# Altium schematic sheet Sheet1.SchDoc
size A; SheetNumber: 1; SheetTotal: 1
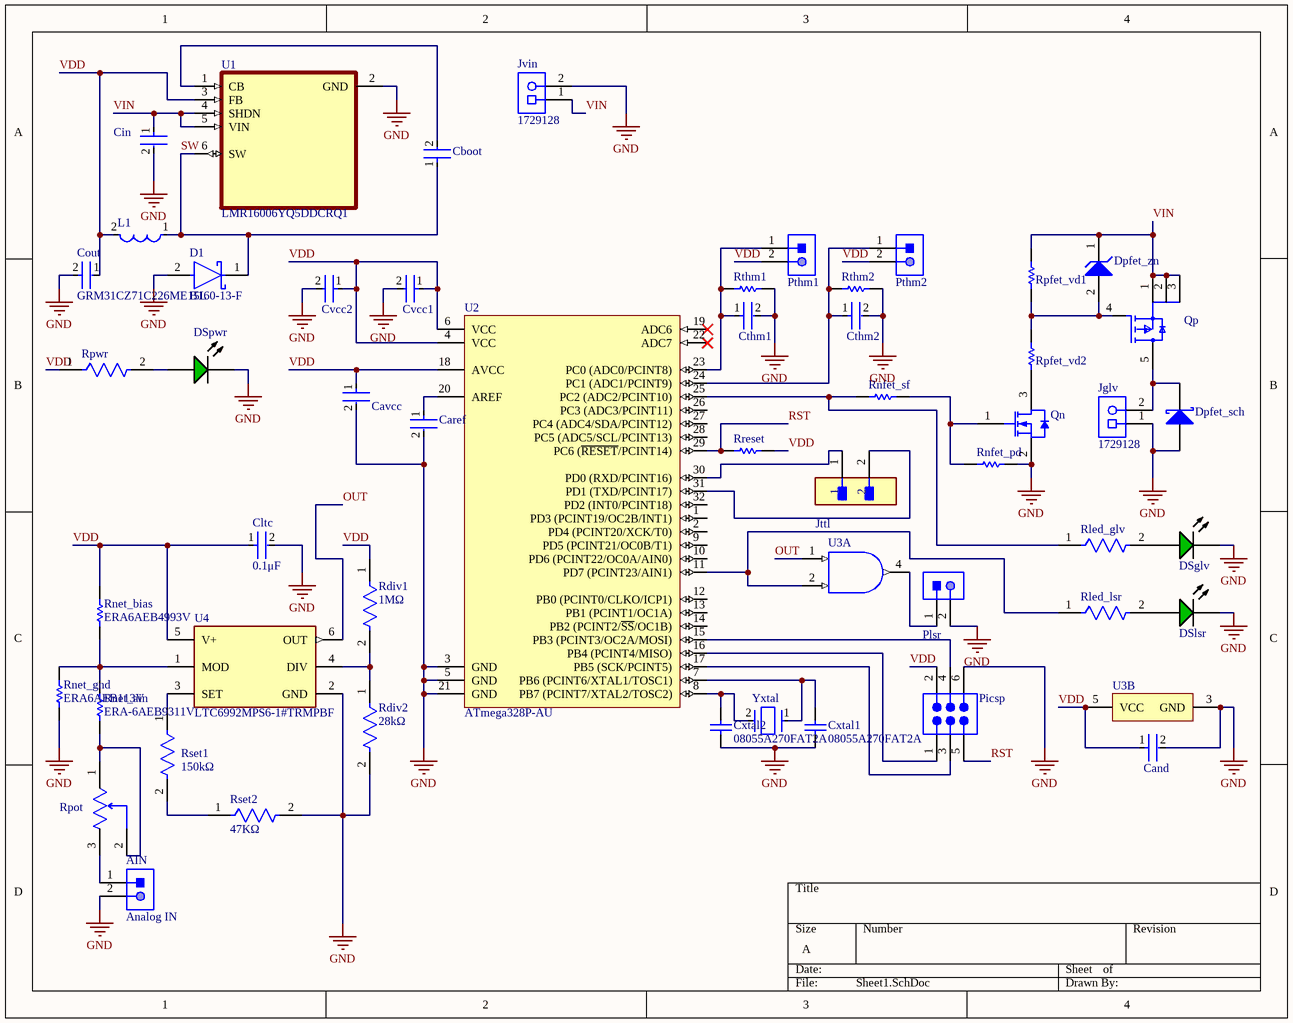
[diagram p0: Sheet1.SchDoc]

## Parts
AIN  Analog IN  [JST-S2B-XH-A(LF)(SN)_V]
Cand  GCM21BR72A104KA37L  [FP-GCM21B-0_15-MFG]  (value not drawn)
Caref  GCM21BR72A104KA37L  [FP-GCM21B-0_15-MFG]  (value not drawn)
Cavcc  GCM21BR72A104KA37L  [FP-GCM21B-0_15-MFG]  (value not drawn)
Cboot  GRM21BR71H474KA88L  [FP-GRM21B-0_1-IPC_B]  (value not drawn)
Cin  GRM31CR71H475KA12L  [FP-GRM31C-0_2-e0_3_0_8-IPC_C]  (value not drawn)
Cltc  0.1μF  [FP-GCM21B-0_15-MFG]
Cout  GRM31CZ71C226ME15L  [FP-GRM31C-0_3-e0_3_0_8-IPC_C]
Cthm1  GCM21BR72A104KA37L  [FP-GCM21B-0_15-MFG]  (value not drawn)
Cthm2  GCM21BR72A104KA37L  [FP-GCM21B-0_15-MFG]  (value not drawn)
Cvcc1  GCM21BR72A104KA37L  [FP-GCM21B-0_15-MFG]  (value not drawn)
Cvcc2  GCM21BR72A104KA37L  [FP-GCM21B-0_15-MFG]  (value not drawn)
Cxtal1  08055A270FAT2A  [CAPC2013X94X50NL20T25]
Cxtal2  08055A270FAT2A  [CAPC2013X94X50NL20T25]
D1  B160-13-F  [FP-SMA-MFG]
Dpfet_sch  B560C-13-F  [DIOD-B5X0C-2_M]  (value not drawn)
Dpfet_zn  MMSZ5245BT1G  [ONSC-SOD-123-2-425-04_V]  (value not drawn)
DSglv  HSMG-C170  [AVAG-HSMX-C170_V]  (value not drawn)
DSlsr  HSMG-C170  [AVAG-HSMX-C170_V]  (value not drawn)
DSpwr  HSMG-C170  [AVAG-HSMX-C170_V]  (value not drawn)
Jglv  1729128  [PHOE-1729128-2_V]
Jttl  TSW-102-07-F-S  [FP-TSW-102-07-F-S-MFG]  (value not drawn)
Jvin  1729128  [PHOE-1729128-2_V]
L1  LQH5BPN100MT0L  [FP-LQH5BPB_T0-MFG]  (value not drawn)
Picsp  MTSW-103-07-F-D-244  [SMTC-MTSW-103-07-X-D-244]  (value not drawn)
Plsr  S2B-XH-A(LF)(SN)  [JST-S2B-XH-A(LF)(SN)_V]  (value not drawn)
Pthm1  S2B-XH-A(LF)(SN)  [JST-S2B-XH-A(LF)(SN)_V]  (value not drawn)
Pthm2  S2B-XH-A(LF)(SN)  [JST-S2B-XH-A(LF)(SN)_V]  (value not drawn)
Qn  2N7002LT1G  [ONSC-SOT-23-3-318-08_V]  (value not drawn)
Qp  SQJ459EP-T1_GE3  [FP-C15-1203-SINGLE-MFG]  (value not drawn)
Rdiv1  1MΩ  [FP-RG2012-MFG]
Rdiv2  28kΩ  [FP-RG2012-MFG]
Rled_glv  CRCW08051K20FKEA  [FP-CRCW0805-e3-MFG]  (value not drawn)
Rled_lsr  CRCW08051K20FKEA  [FP-CRCW0805-e3-MFG]  (value not drawn)
Rnet_ain  ERA-6AEB9311V  [RESC2013X60X40ML20T25]
Rnet_bias  ERA6AEB4993V  [RESC2013X60X40ML20T25]
Rnet_gnd  ERA6AEB113V  [RESC2013X60X40NL20T25]
Rnfet_pd  ERA-6AEB103V  [RESC2013X60X40LL20T25_A]  (value not drawn)
Rnfet_sf  ERA6AEB331V  [RESC2013X60X40LL20T25]  (value not drawn)
Rpfet_vd1  ERA-6AEB103V  [RESC2013X60X40LL20T25_A]  (value not drawn)
Rpfet_vd2  ERA-6AEB103V  [RESC2013X60X40LL20T25_A]  (value not drawn)
Rpot  3296W-1-202LF  [FP-3296W-MFG]  (value not drawn)
Rpwr  CRCW08051K20FKEA  [FP-CRCW0805-e3-MFG]  (value not drawn)
Rreset  ERA-6AEB103V  [RESC2013X60X40LL20T25_A]  (value not drawn)
Rset1  150kΩ  [FP-ERA6A-MFG]
Rset2  47KΩ  [FP-ERA6A-MFG]
Rthm1  ERA-6AEB103V  [RESC2013X60X40LL20T25_A]  (value not drawn)
Rthm2  ERA-6AEB103V  [RESC2013X60X40LL20T25_A]  (value not drawn)
U1  LMR16006YQ5DDCRQ1  [SOT95P280X110-6N]
U2  ATmega328P-AU  [32A_M]
U3  SN74LVC1G08DBVR  [DBV0005A_M]  (value not drawn)  (parts A,B of 2)
U4  LTC6992MPS6-1#TRMPBF  [FP-S6-6-05-08-1636-IPC_B]
Yxtal  ABLS-16.000MHZ-K4T  [FP-ABLS-MFG]  (value not drawn)

## Nets
GND: AIN.2 Cand.2 Caref.2 Cavcc.2 Cin.2 Cltc.2 Cout.2 Cthm1.2 Cthm2.2 Cvcc1.2 Cvcc2.2 Cxtal1.1 Cxtal2.1 D1.2(A) Dpfet_sch.2(A) DSglv.2(K) DSlsr.2(K) DSpwr.2(K) Jglv.1 Jvin.2 Picsp.6 Plsr.2 Qn.2(S) Rdiv2.2 Rnet_gnd.1 Rnfet_pd.2 Rset2.2 Rthm1.2 Rthm2.2 U1.2(GND) U2.3(GND) U2.5(GND) U2.21(GND) U3.3(GND) U4.2(GND)
OUT: U3.1(A) U4.6(OUT)
RST: Picsp.5 Rreset.1 U2.29(PC6_(~{RESET}/PCINT14))
SW: Cboot.1 D1.1(C) L1.1 U1.6(SW)
VDD: Cand.1 Cavcc.1 Cltc.1 Cout.1 Cvcc1.1 Cvcc2.1 L1.2 Picsp.2 Pthm1.2 Pthm2.2 Rdiv1.1 Rnet_bias.2 Rpwr.1 Rreset.2 U1.3(FB) U2.4(VCC) U2.6(VCC) U2.18(AVCC) U3.5(VCC) U4.5(V+)
VIN: Cin.1 Dpfet_zn.1(K) Jvin.1 Qp.1(S) Qp.2(S) Qp.3(S) Rpfet_vd1.2 U1.4(SHDN) U1.5(VIN)
NetAIN_1: AIN.1 Rpot.3(CW)
NetCaref_1: Caref.1 U2.20(AREF)
NetCboot_2: Cboot.2 U1.1(CB)
NetCthm1_1: Cthm1.1 Pthm1.1 Rthm1.1 U2.23(PC0_(ADC0/PCINT8))
NetCthm2_1: Cthm2.1 Pthm2.1 Rthm2.1 U2.24(PC1_(ADC1/PCINT9))
NetCxtal1_2: Cxtal1.2 U2.7(PB6_(PCINT6/XTAL1/TOSC1)) Yxtal.1
NetCxtal2_2: Cxtal2.2 U2.8(PB7_(PCINT7/XTAL2/TOSC2)) Yxtal.2
NetDpfet_sch_1: Dpfet_sch.1(K) Jglv.2 Qp.5(D)
NetDpfet_zn_2: Dpfet_zn.2(A) Qp.4(G) Rpfet_vd1.1 Rpfet_vd2.1
NetDSglv_1: DSglv.1(A) Rled_glv.2
NetDSlsr_1: DSlsr.1(A) Rled_lsr.2
NetDSpwr_1: DSpwr.1(A) Rpwr.2
NetJttl_1: Jttl.1 U2.30(PD0_(RXD/PCINT16))
NetJttl_2: Jttl.2 U2.31(PD1_(TXD/PCINT17))
NetPicsp_1: Picsp.1 U2.16(PB4_(PCINT4/MISO))
NetPicsp_3: Picsp.3 U2.17(PB5_(SCK/PCINT5))
NetPicsp_4: Picsp.4 U2.15(PB3_(PCINT3/OC2A/MOSI))
NetPlsr_1: Plsr.1 U3.4(Y)
NetQn_1: Qn.1(G) Rnfet_pd.1 Rnfet_sf.2
NetQn_3: Qn.3(D) Rpfet_vd2.2
NetRdiv1_2: Rdiv1.2 Rdiv2.1 U4.4(DIV)
NetRled_glv_1: Rled_glv.1 Rnfet_sf.1 U2.25(PC2_(ADC2/PCINT10))
NetRled_lsr_1: Rled_lsr.1 U2.11(PD7_(PCINT23/AIN1)) U3.2(B)
NetRnet_ain_1: Rnet_ain.1 Rpot.1(CCW) Rpot.2(WIPER)
NetRnet_ain_2: Rnet_ain.2 Rnet_bias.1 Rnet_gnd.2 U4.1(MOD)
NetRset1_1: Rset1.1 U4.3(SET)
NetRset1_2: Rset1.2 Rset2.1

Not connected (* = marked no-connect by the designer): U2 1(PD3_(PCINT19/OC2B/INT1)) 2(PD4_(PCINT20/XCK/T0)) 9(PD5_(PCINT21/OC0B/T1)) 10(PD6_(PCINT22/OC0A/AIN0)) 12(PB0_(PCINT0/CLKO/ICP1)) 13(PB1_(PCINT1/OC1A)) 14(PB2_(PCINT2/~{SS}/OC1B)) 19(ADC6)* 22(ADC7)* 26(PC3_(ADC3/PCINT11)) 27(PC4_(ADC4/SDA/PCINT12)) 28(PC5_(ADC5/SCL/PCINT13)) 32(PD2_(INT0/PCINT18))

## Library data of the parts
AIN Plsr Pthm1 Pthm2 = CMP-1755-00005-1: Male Header, Pitch 2.5 mm, 1 x 2 Position, Height 6.1 mm, Tail Length 3.4 mm, -25 to 85 degC, RoHS, Bulk; Type (Capacitors): X7R; Voltage Rating (DC): 100 V; Tolerance: 10%; Capacitance: 1 nF; Case\Package: Radial; Min Operating Temperature: -55 degC; Mount: Through Hole; Package Quantity: 500; PackageReference: S2B-XH-A(LF)(SN); ComponentLink1Description: Manufacturer URL; Max Operating Temperature: 125 degC; ComponentLink2Description: Datasheet; RoHSCompliant: true; PackageDescription: Male Header, Pitch 2.5 mm, 1 x 2 Position, Height 6.1 mm, Tail Length 3.4 mm; REACH SVHC: No SVHC; Packaging: Bulk; Width: 3.81 mm; Length: 5.33 mm; Height: 2.54 mm; Pins: 2; Radiation Hardening: No; ComponentLink1URL: http://www.jst.com/home2.html; Lead Pitch: 2.54 mm; DatasheetVersion: May-16; Voltage Rating: 100 V; ComponentLink2URL: http://www.jst-mfg.com/product/pdf/eng/eXH.pdf
Cand Caref Cavcc Cltc Cthm1 Cthm2 Cvcc1 Cvcc2 = CMP-2007-03364-2: Ceramic Capacitor for Automotive 100nF ±10% 100VDC X7R 0805 Embossed T/R; Voltage Rating: 100V; Termination: SMD/SMT; Tolerance: 10%; Case Code (Imperial): 0805; Length: 2mm; Max Operating Temperature: 125°C; Case/Package: 0805; Mount: Surface Mount; Packaging: Tape and Reel; Package Quantity: 1; Min Operating Temperature: -55°C; Case Code (Metric): 2012; Radiation Hardening: No; REACH SVHC: No SVHC; Dielectric: X7R; Depth: 1.25mm; Lead Free: Lead Free; Ratings: AEC-Q200; Height: 1.25mm; Voltage: 100V; Capacitance: 100nF; Voltage Rating (DC): 100V; Width: 0.049inch; Thickness: 0.055inch
Cboot = CMP-06035-060025-1: Chip Multilayer Ceramic Capacitors for General Purpose, 0805, 0.47uF, X7R, 15%, 10%, 50V; Capacitance: 470nF; Material: Ceramic; Voltage Rating: 50V; Case Code (Imperial): 0805; Depth: 1.25mm; Voltage Rating (DC): 50V; Dielectric: X7R; Construction: Flat; Min Operating Temperature: -55°C; Size: 1.25mm; Package Quantity: 1; Series: GRM; Width: 0.049inch; Case/Package: 0805; Lead Free: Lead Free; Thickness: 0.053inch; Case Code (Metric): 2012; Length: 2mm; Height: 1.25mm; Termination: SMD/SMT; Mount: Surface Mount; Voltage: 50V; Packaging: Tape and Reel; Max Operating Temperature: 125°C; REACH SVHC: No SVHC; Tolerance: 10%
Cin = CMP-1037-04923-3: Chip Multilayer Ceramic Capacitors for General Purpose, 1206, 4.7uF, X7R, 15%, 10%, 50V; Height: 1.6mm; Voltage: 50V; Capacitance: 4.7uF; Lead Free: Lead Free; Max Operating Temperature: 125°C; Packaging: Tape and Reel; REACH SVHC: No SVHC; Voltage Rating: 50V; Mount: Surface Mount; Termination: SMD/SMT; Tolerance: 10%; Case/Package: 1206; Material: Ceramic; Depth: 1.6mm; Length: 3.2mm; Case Code (Metric): 3216; Voltage Rating (DC): 50V; Case Code (Imperial): 1206; Radiation Hardening: No; Width: 0.063inch; Thickness: 0.071inch; Package Quantity: 2000; Min Operating Temperature: -55°C; Dielectric: X7R
Cout = CMP-06035-055218-1: Chip Multilayer Ceramic Capacitors for General Purpose, 1206, 22uF, X7R, 15%, 20%, 16V
Cxtal1 Cxtal2 = CMP-2007-04304-1: Manufacturer: AVX Interconnect / Elco; Part Number: 08055A270FAT2A
D1 = CMP-2000-05885-2: DIODE SCHOTTKY 60V 1A SMA; Polarity: Standard; Element Configuration: Single; Peak Reverse Current: 500uA; Capacitance: 110pF; Peak Non-Repetitive Surge Current: 30A; Forward Voltage: 700mV; Termination: SMD/SMT; Radiation Hardening: No; Number of Pins: 2; Packaging: Tape and Reel; Length: 4.6mm; Current Rating: 1A; Lead Free: Lead Free; Output Current: 1A; Max Operating Temperature: 150°C; Min Operating Temperature: -65°C; Forward Current: 1A; Mount: Surface Mount; Width: 2.92mm; Average Rectified Current: 1A; Max Forward Surge Current (Ifsm): 30A; Voltage Rating (DC): 60V; Height: 2.1mm; REACH SVHC: No SVHC; Max Reverse Voltage (DC): 60V; Max Repetitive Reverse Voltage (Vrrm): 60V; Weight: 0.002258oz; Contact Plating: Tin; Case/Package: SMA; Package Quantity: 5000
Dpfet_sch = CMP-2000-05098-2: Schottky Barrier Rectifier, 5 A, 60 V, -55 to 125 degC, 2-Pin SMD, RoHS, Tape and Reel; Ir - Reverse Current: 500uA; Configuration: Single; Ifsm - Forward Surge Current: 100A; Vrrm - Repetitive Reverse Voltage: 60V; Brand: DiodesIncorporated; Vf - Forward Voltage: 0.7V; If - Forward Current: 5A; Unit Weight: 0.007408oz; Type: SchottkyBarrierRectifier; Package / Case: SMC; Manufacturer URL: http://www.diodes.com/; Datasheet URL: https://datasheet.ciiva.com/27052/1538961-27052355.pdf; Factory Pack Quantity: 3000; Height: 2.5mm; Width: 6.22mm; Product Category: SchottkyDiodes&Rectifiers; Minimum Operating Temperature: -55C; Manufacturer: DiodesIncorporated; Datasheet Version: Rev. 7-2, 06/2007; Product: SchottkyDiodes; Maximum Operating Temperature: +125C; Operating Temperature Range: -55Cto+125C; Technology: Si; Length: 7.11mm; RoHS: True; Packaging: Reel; Termination Style: SMD/SMT; Series: B560; Mounting Style: SMD/SMT
Dpfet_zn = CMP-1060-00535-1: Zener Voltage Regulator, 500 mW, 2-Pin SOD-123, Pb-Free, Tape and Reel; Manufacturer: On Semiconductor; P Max (W): 0.5; VZ Typ (V): 15; ComponentLink3URL: http://www.onsemi.com/pub_link/Collateral/425-04.PDF; Packing: Tape and Reel; DatasheetVersion: Rev. 12; ComponentLink2URL: http://www.onsemi.com/pub_link/Collateral/MMSZ5221BT1-D.PDF; Mounting Technology: Surface Mount; ComponentLink1Description: Manufacturer URL; ComponentLink1URL: http://www.onsemi.com/; ComponentLink2Description: Datasheet; PackageVersion: Rev. G, 10/2009; PackageReference: SOD-123-2-425-04; PackageDescription: 2-Pin SOD, Body 1.6 x 2.69 mm; ComponentLink3Description: Package Specification; RoHS: Pb-Free; PartNumber: MMSZ5245BT1G
DSglv DSlsr DSpwr = CMP-2000-05062-1: Chip LED, Green, 2.2 V, -40 to 85 degC, 2-Pin SMD, Pb-Free, Tape and Reel; Manufacturer: Avago; No. of Pins: 2; Peak Wavelength: 570nm; SVHC: NoSVHC(16-Jun-2014); Dominant Wavelength: 572nm; Forward Current If: 20mA; Viewing Angle: 170deg; Lens Shape: Rectangular; PIV Max: 5V; External Width: 1.25mm; LED Type: Standard; External Depth: 0.8mm; Opto Mounting Orientation: Top; Luminous Intensity: 15mcd; Luminous Intensity Min: 4mcd; Forward Voltage VF Max: 2.6V; External Length / Height: 2mm; Bulb Size: 1.25mmx1.4mm; Light Area Height: 1mm; Voltage Vf Typ: 2.2V; Operating Temperature Max: 85degC; Datasheet Version: Oct-08; MSL: MSL2A-4weeks; Peak Forward Current: 20mA; Package Description: 2-Pin Surface Mount Device, Body 2 x 1.25 mm, Height 0.8 mm; Datasheet URL: https://datasheet.ciiva.com/29280/180495-da-01-en-chip-led-hsmg-c170-gelb-gruen-29280971.pdf; Storage Temperature Min: -40degC; LED Colour: Green; Wavelength Typ: 570nm; Mounting Type: SMD; Forward Current If Max: 20mA; Dominant Wavelength Typ: 572nm; LED Mounting: SMD; Operating Temperature Range: -30degCto+85degC; Operating Temperature Min: -30degC; Manufacturer URL: http://www.avagotech.com/; Packaging: CutTape; Luminous Intensity Typ: 15mcd; Package Reference: HSMX-C170; Storage Temperature Max: 85degC; Opto Case Style: SMD; Forward Voltage: 2.2V
Jglv Jvin = CMP-2000-05815-1: PCB Terminal Block, 13.5 A, 400 V, 2-Pin THD, RoHS, Bulk; Manufacturer: Phoenix Contact; Package Version: 03/2015; No. of Rows: 1; Pitch: 5.08mm; No. of Positions: 2; Voltage Rating: 400V; Current Rating: 13500mA; Manufacturer URL: http://www.phoenixcontact.com/; Datasheet URL: https://datasheet.ciiva.com/16046/1729128-16046181.pdf; RoHS: TRUE; Package URL: https://www.phoenixcontact.com/online/portal/pi/pxc/product_detail_page/!ut/p/b1/3VdJjqNKFDxLH8AFycySyWY2ozFsEPOMMQaDOX1XedGL_1Vdm5YXJleknhSKeBkvI6EA8ncAo3AYoDhBQGco6KN7VURTdemj9us_IEKEZo_YHiPAEWEFmDGOHMORkqKYCORBZxgL7ZoaZYcbFFUZ3fqxSY6GOuxydWUuHqz1ynmMFygu583Bob0Ewr6Sd_l-5m-kAueHiB0jpRwZwe58wwtkpxtMYd_LmGcDRU02dRNEyWt6Y2ti5pSyJ_reIkzIulrqApdnbT11V5jnCKbYNCvhEM1MCpPByat_X379-iThf08CI5GfOPqfBeS3BRoBOdD55AKVv0iLwCMq-2BrzXWSGRH7pUGD9uwXQjiph3xL0DKQwdGa0JImiIOmBNOestqgwTHSSs2oOep-78apyXQBvNi8ZLaFjvjWvcaUEBu0MC6Wbe-d6mB0FAebo2lUWinqYaZs5DAYzV0RP9yitUjnGJ0iI9xhZkT42OCQNUJJhkgWINNQLP2JFP6OpMg3JCVg70jqHT0lvKOnhHf0lPuOnnLf0VPuWx6_dxwUIvwk5WMkT0kLL1mh61l2yZVSzG3pYV_bqo-mj6uMKwKwdnnW8Jh5RTOJzMOA5c-eJDaZQw4mTMPH02PvS_ZAqNVjVTo2WyYLkwH_KU1mmmG5kjRhDqPXLwwVHvVOjCM60-fpXvTDfMGW1PVFVS1r4e4yVDk4ZdNbkUHvqPqQSeian4UD39fNKmachqdJ1NJbyk8rXT9mXTvPk3oE5meulKGgiruPJek-4I9hTT6G8ZLOyRSm2RRVbThERQad5OS28hdt4YW4vG0stgYYzsWsK4_7y6DZMjJSCqri1kyiZR5vD7pwIrNR7QwPHTcLTI5qT7eRlpHrdGiupYlqQDJ7zy_CND8fWWBoLRXxk1RVcXiBQwbTD4Xi7KL-FuO94t9xaqweXzH; PartNumber: 1729128; Package Description: 2-Pin Through Hole Device, Body 8.1 x 10.16 mm, Pitch 5.08 mm; Datasheet Version: 12/2013; Mounting Technology: ThroughHole; Orientation: Horizontal; Package Reference: 1729128-2; Packing: Bulk
Jttl = CMP-02766-001458-1: CONN HEADER VERT 2POS 2.54MM; Gender: Male; Max Current Rating: 7.6A; Number of Contacts: 2; Max Voltage Rating (AC): 550V; Orientation: Straight; Depth: 2.54mm; Series: TSW; Package Quantity: 1; Min Operating Temperature: -55°C; Max Operating Temperature: 125°C; Contact Type: Male Pin; Contact Shape: Square; Color: Black; Housing Color: Black; Connector Type: Header; Fastening Type: Pull; Radiation Hardening: No; Pitch: 2.54mm; Housing Material: Polyester; Mount: Through Hole; Number of Positions: 2; Number of Rows: 1; Contact Material: Bronze; Insulation Color: Black; Contact Finish - Mating: GOLD; Termination: Solder; Insulation Material: PBT; Length: 5.08mm; Flammability Rating: UL94 V-0; Contact Mating Length: 0.23inch; REACH SVHC: No SVHC; Contact Plating: Gold; RoHS Compliant: Yes; Packaging: Bulk
L1 = CMP-06042-011567-1: Wire Wound Ferrite Inductor for Power Lines 10μH ±20% 0.1272Ω 1.60A 2020; Current Rating: 1.6A; Inductance: 10uH; Max DC Current: 2A; Test Frequency: 100kHz; Self Resonant Frequency: 25MHz; Shielding: Shielded; DC Resistance (DCR): 106mR; Core Material: Ferrite; Tolerance: 20%; Height - Seated (Max): 0.086inch; Inductance Tolerance: 20%; Lead Free: Lead Free; Depth: 5.2mm; Length: 5mm; Height: 2mm; Width: 5mm; Mount: Surface Mount; DC Current: 1.6A; Termination: SMD/SMT; REACH SVHC: No SVHC; Resistor Type: Wirewound; Package Quantity: 1; Case/Package: 2020; Max Operating Temperature: 125°C; Case Code (Imperial): 2220; Case Code (Metric): 5650; Packaging: Tape and Reel; Min Operating Temperature: -40°C; Military Standard: Not
Picsp = CMP-1024-00098-1: Modified .025" SQ Post Header, Through-hole, Vertical, -55 to 125 degC, 2.54 mm Pitch, 6-Pin, Male, RoHS; Manufacturer: Samtec; Pitch: 2.54 mm; DatasheetVersion: F-214; Orientation: Vertical; PackageDescription: Assembly .025" [.64] SQ Post Terminal Strip; ComponentLink1Description: Manufacturer URL; ComponentLink3Description: Package Specification; PackageVersion: BI, 2/1987; ComponentLink1URL: http://www.samtec.com; PackageReference: MTSW-103-07-X-D-244; ComponentLink3URL: http://www.samtec.com/documents/webfiles/cpdf/MTSW-XXX-XX-X-X-XXXX-XX-XXX-MKT1.pdf; Temperature Range: -55 to 125 degC; Mounting Technology: Through-hole; PartNumber: MTSW-103-07-F-D-244; RoHS: True; ComponentLink2URL: http://www.samtec.com/documents/webfiles/pdf/MTSW.PDF; ComponentLink2Description: Datasheet
Qn = CMP-1058-00781-1: Small Signal MOSFET, 60 V, 115 mA, N-Channel, 3-Pin SOT-23, Pb-Free, Tape and Reel; Manufacturer: On Semiconductor; Channel Polarity: N Channel; V(BR)DSS Min (V): 60; ID Max (A): 0.115; VGS Max (V): 20; Configuration: Single; VGS(th) Max (V): 2.5; ComponentLink1URL: http://www.onsemi.com/; ComponentLink3Description: Package Specification; ComponentLink3URL: http://www.onsemi.cn/pub_link/Collateral/318-08.PDF; PackageReference: SOT-23-3-318-08; RoHS: Pb-Free; ComponentLink2URL: http://www.onsemi.com/pub_link/Collateral/2N7002L-D.PDF; ComponentLink1Description: Manufacturer URL; Package Type: SOT-23-3; Packing: Tape and Reel; PartNumber: 2N7002LT1G; DatasheetVersion: Rev. 7; Mounting Technology: Surface Mount; ComponentLink2Description: Datasheet; PackageDescription: 3-Pin Small Outline Transistor, Body 2.92 x 1.3 mm, Pitch 0.95 mm; PackageVersion: Rev. AP, 11/2009
Qp = CMP-02550-000107-1: MOSFET P-CH 60V 52A POWERPAKSO-8; Manufacturer: Vishay; Depletion Mode: False; Automotive Grade: Grade 0; Gate To Source Voltage: 20V; Drain To Source Breakdown Voltage: -60V; Transconductance: 40S; Typ Forward Diode Voltage: -0.8V; Turn On Delay Time: 12ns; Threshold Vgs Min: -1.5V; Continuous Drain Current: -52A; Number Of Channels: 1; Threshold Vgs Max: -2.5V; Pulse Drain Current: -200A; Max Forward Diode Voltage: -1.2V; Standoff Height: 0mm; Input Capacitace At Vds: 3448pF @ -30V; Power Dissipation: 83W; Rthja Max: 65°C/W; Drain To Source Resistance: 0.0155Ω; Gate Charge At Vgs: 73nC @ -10V; Turn Off Delay Time: 88ns; Max Junction Temp: +175°C; Package: C15-1203-SINGLE; ComponentLink2URL: http://www.vishay.com/docs/66963/sqj459ep.pdf; Device Class L2: Transistors; Manufacturer Part Number: SQJ459EP-T1_GE3; Temperature Range High: +175°C; Temperature Range Low: -55°C; Category: Trans; Automotive: Yes; Height: 1.267mm; Device Class L3: MOSFETs; Temperature: -55°C to +175°C; Lead Free: Yes; Drain To Source Voltage: -60V; ComponentLink2Description: Datasheet; Octopart: https://octopart.com/sqj459ep-t1_ge3-vishay-73080141; Device Class L1: Discrete Semiconductors; Number Of P Channels: 1; RoHS: TRUE; Digikey Description: MOSFET P-CH 60V 52A POWERPAKSO-8
Rdiv1 = CMP-2001-02713-2: Automotive Metal Thin Film Chip Resistor, 0805, 1MΩ, 0.1%, 25ppm/°C, 0.125W, 150V; Max Power Dissipation: 125mW; Power Rating: 100mW; Resistance: 1MR; Voltage Rating: 100V; Voltage Rating (DC): 150V; Lead Free: Lead Free; Length: 2mm; Number of Terminations: 2; RoHS Compliant: Yes; Case/Package: 0805; Height: 0.4mm; Case Code (Metric): 2012; Temperature Coefficient: 25ppm/°C; Features: Automotive AEC-Q200; Package Quantity: 5000; Width: 1.25mm; Termination: SMD/SMT; Case Code (Imperial): 0805; Tolerance: 0.1%; Max Operating Temperature: 155°C; Packaging: Tape and Reel; Min Operating Temperature: -55°C; Series: RG
Rdiv2 = CMP-2001-02887-2: Automotive Metal Thin Film Chip Resistor, 0805, 280kΩ, 0.1%, 25ppm/°C, 0.125W, 150V; Resistance: 280kR; Power Rating: 125mW; Voltage Rating: 150V; Max Operating Temperature: 155°C; Width: 0.049inch; Case Code (Metric): 2012; Min Operating Temperature: -55°C; Features: Automotive AEC-Q200; RoHS Compliant: Yes; Termination: SMD/SMT; Temperature Coefficient: 25ppm/°C; Number of Terminations: 2; Voltage Rating (DC): 150V; Case/Package: 0805; Weight: 0.000194oz; Package Quantity: 1; Resistor Type: Thin Film; Packaging: Tape and Reel; Height: 0.02inch; Series: RG; Max Power Dissipation: 125mW; Length: 0.079inch; Case Code (Imperial): 0805; Lead Free: Lead Free; Tolerance: 0.1%
Rled_glv Rled_lsr Rpwr = CMP-2001-03607-2: RES Thick Film, 1.2kΩ, 1%, 0.125W, 100ppm/°C, 0805; Max Power Dissipation: 125mW; Voltage Rating (DC): 150V; Resistance: 1.2kR; Military Standard: Not; Termination: SMD/SMT; Package Quantity: 10; Min Operating Temperature: -55°C; Weight: 0.000194oz; Width: 0.049inch; Voltage Rating: 150V; Temperature Coefficient: 100ppm/°C; Case Code (Imperial): 0805; Packaging: Tape and Reel; Composition: Thick Film; Lead Free: Lead Free; Number of Terminations: 2; Depth: 1.25mm; Power Rating: 125mW; Tolerance: 1%; Radiation Hardening: No; Length: 2mm; Case Code (Metric): 2012; Max Operating Temperature: 155°C; Height: 0.45mm; Features: Automotive AEC-Q200; Contact Plating: Tin; Case/Package: 0805
Rnet_ain = CMP-2001-00644-1: Part Number: ERA6AEB472V; Manufacturer: Panasonic
Rnet_bias = CMP-2001-00840-1: Manufacturer: Panasonic; Part Number: ERA6AEB4993V
Rnet_gnd = CMP-2001-00586-1: Manufacturer: Panasonic; Part Number: ERA6AEB113V
Rnfet_pd Rpfet_vd1 Rpfet_vd2 Rreset Rthm1 Rthm2 = CMP-2001-00582-2: Metal Film Chip Resistor, High Reliability Type, 0.125 W, +/- 0.1%, -55 to 155 degC, 0805 (2012 Metric), RoHS, Tape and Reel; Voltage Rating: 100V; Power Rating: 125mW(1/8W); Brand: Panasonic; Temperature Coefficient: 25PPM/C; Resistance: 10kOhms; Product Category: ThinFilmResistors-SMD; Datasheet Version: 02/2016; Operating Temperature Range: -55Cto+155C; Length: 2mm; Mounting Technology: SurfaceMount; Manufacturer URL: http://www.panasonic.com/; Width: 1.25mm; Packaging: Reel; Product: ThinFilmResistorsSMD; Package / Case: 0805(2012metric); Termination Style: SMD/SMT; Tolerance: 0.1%; Datasheet URL: https://industrial.panasonic.com/cdbs/www-data/pdf/RDM0000/AOA0000C307.pdf; Package Description: 2-Pin Surface Mount Device, Body 2 x 1.25 mm; Factory Pack Quantity: 5000; Series: ERA-6A; Case Code - mm: 2012; RoHS: Details; Package Reference: 0805; Height: 0.5mm; Manufacturer: Panasonic; Case Code - in: 0805; Type: MetalFilmChipResistors
Rnfet_sf = CMP-2001-00628-1: Manufacturer: Panasonic; Part Number: ERA6AEB331V
Rpot = CMP-2000-05582-2: TRIMMER 2K OHM 0.5W PC PIN TOP; Resistance Tolerance: 10%; Max Power Dissipation: 500mW; Number of Turns: 25; Temperature Coefficient: 100ppm/°C; Resistance: 2kR; Taper: Linear; Width: 9.53mm; Radiation Hardening: No; Length: 9.53mm; Packaging: Rail/Tube; Lead Free: Lead Free; Mount: Panel; Min Operating Temperature: -55°C; Power Rating: 500mW; RoHS Compliant: Yes; REACH SVHC: No SVHC; Color: Blue; Package Quantity: 50; Contact Plating: Tin; Weight: 0.03oz; Technology: CERMET; Max Operating Temperature: 125°C; Tolerance: 10%; Termination: Pin; Resistor Type: Cermet; Military Standard: Not; Height: 0.395inch; Series: 3296; Depth: 4.83mm
Rset1 = CMP-2001-00599-2: RES 150K OHM 0.1% 1/8W 0805; Voltage Rating: 100V; Power Rating: 125mW; Resistance: 150kR; Temperature Coefficient: 25ppm/°C; Termination: SMD/SMT; Number of Terminations: 2; Case Code (Metric): 2012; Number of Pins: 2; Radiation Hardening: No; Technology: METAL FILM; Construction: Rectangular; Contact Plating: Tin; Width: 1.25mm; Resistor Type: Thin Film; Length: 2mm; Max Power Dissipation: 125mW; Mount: Surface Mount; REACH SVHC: No SVHC; Packaging: Tape and Reel; Min Operating Temperature: -55°C; Lead Free: Lead Free; Resistance Tolerance: 0.1%; Depth: 1.25mm; RoHS Compliant: Yes; Military Standard: Not; Max Operating Temperature: 155°C; Package Quantity: 5000; Series: ERA-6A; Height: 0.5mm; Case Code (Imperial): 0805; Tolerance: 0.1%; Voltage Rating (DC): 100V; Case/Package: 0805
Rset2 = CMP-2001-00645-2: NexarPartId: 1264112; Voltage Rating (DC): 100V; Max Power Dissipation: 125mW; Temperature Coefficient: 25ppm/°C; Tolerance: 0.1%; Case Code (Metric): 2012; Packaging: Cut Tape; Number of Terminations: 2; Max Operating Temperature: 155°C; Height: 500µm; Number of Pins: 2; Min Operating Temperature: -55°C; Resistance: 47kΩ; RoHS: Compliant; Features: Automotive AEC-Q200; Schedule B: 8533210045, 8533210045; Contact Plating: Tin; Case Code (Imperial): 0805; Lead Free: Lead Free; Lifecycle Status: Production; Termination: SMD/SMT; Weight: 5.499807mg; REACH SVHC: No SVHC; Voltage Rating: 100V; Mount: Surface Mount; Radiation Hardening: No; Military Standard: Not; Power Rating: 125mW; Length: 2mm; Depth: 1.25mm; Width: 1.25mm; Composition: Metal Film, Thin Film; Case/Package: 0805
U1 = LMR16006YQ5DDCRQ1: Automotive Qualified SIMPLE SWITCHERÂ® 40V (65V transient), 0.6A Buck Regulator with 28Î¼A IQ; MF: Texas Instruments; SnapEDA_Link: https://www.snapeda.com/parts/LMR16006YQ5DDCRQ1/Texas+Instruments/view-part/?ref=snap; Package: SOT-23-THN-6 Texas Instruments; Value: *; MP: LMR16006YQ5DDCRQ1; Check_prices: https://www.snapeda.com/parts/LMR16006YQ5DDCRQ1/Texas+Instruments/view-part/?ref=eda
U2 = CMP-0095-00269-2: 8-bit AVR Microcontroller, 32KB Flash, 1KB EEPROM, 2KB SRAM, 32-pin TQFP, Industrial Grade (-40°C to 85°C); PackageDescription: 32-Lead, 7x7x1.0 mm Body, 0.8mm Lead Pitch, Thin Profile Plastic Quad Flat Package (TQFP); DatasheetVersion: revD, May-2011; RevisionNote: DatasheetVersion & PackageVersion updated. URLs added.; ComponentLink1URL: http://www.atmel.com/; ComponentLink2Description: ATmega48A/48PA/88A/88PA/168A/168PA/328/328P Datasheet; Code_JEDEC: MS-026-ABA; ComponentLink1Description: Manufacturer URL; PackageReference: 32A; ComponentLink3Description: ATmega48A/48PA/88A/88PA/168A/168PA/328/328P Summary; ComponentLink2URL: http://www.atmel.com/dyn/resources/prod_documents/doc8271.pdf; PackageVersion: revC, Oct-2010; ComponentLink3URL: http://www.atmel.com/dyn/resources/prod_documents/8271S.pdf
U3 = CMP-0859-00053-3: Single 2-Input Positive-AND Gate, DBV0005A, LARGE T&R; Manufacturer: Texas Instruments; Logic: True; ICC @ Nom Voltage(Max)(mA): 0.01; VCC(Min)(V): 1.65; Bits(#): 1; Rating: Catalog; Schmitt Trigger: No; Voltage(Nom)(V): 1.8,2.5,3.3,5; Output Drive (IOL/IOH)(Max)(mA): 32/-32; Gate Type: AND; tpd @ Nom Voltage(Max)(ns): 4.5,6,4,5; VCC(Max)(V): 5.5; Output Type: CMOS; F @ Nom Voltage(Max)(Mhz): 150; Input Type: CMOS/TTL; Technology Family: LVC; Sub-Family: AND Gate; PackageReference: DBV0005A; Generic Part Number: SN74LVC1G08; Operating Temperature Range(C): -40 to 125,-40 to 85; 3-State Output: No; DatasheetVersion: SCES217Y
U4 = CMP-09075-000003-1: IC OSC SILICON PROG TSOT23-6; Operating Supply Current: 365uA; Frequency: 3.81Hz; Package Quantity: 500; Mount: Surface Mount; Max Operating Temperature: 125°C; Case/Package: SOT-23-6; Min Operating Temperature: -55°C; RoHS Compliant: Yes; Number of Pins: 6; Series: TimerBlox®; Packaging: Tape and Reel
Yxtal = CMP-27762-000003-1: CRYSTAL 16.0000MHZ 18PF SMD; Manufacturer: Abracon; Frequency: 16MHz; Stability: 50ppm; Tolerance: 30ppm; Standoff Height: 0mm; Esr: 40Ω; ComponentLink2URL: https://abracon.com/Resonators/abls.pdf; Temperature Range High: +125°C; Package: ABLS; Device Class L3: Crystals; Temperature: -40°C to +125°C; Load Capacitance: 18pF; Device Class L2: Crystals / Oscillators; Mouser Description: Crystal 16MHz ±30ppm (Tol) ±50ppm (Stability) 18pF FUND 40Ohm 2-Pin HC-49/US SMD T/R; Category: Crys; ComponentLink2Description: Datasheet; Manufacturer Part Number: ABLS-16.000MHZ-K4T; Series: ABLS; Automotive: No; Octopart: https://octopart.com/abls-16.000mhz-k4t-abracon-18618626; RoHS: TRUE; Digikey Description: CRYSTAL 16.0000MHZ 18PF SMD; Temperature Range Low: -40°C; Lead Free: Yes; Height: 4.3mm; Device Class L1: Passive Components